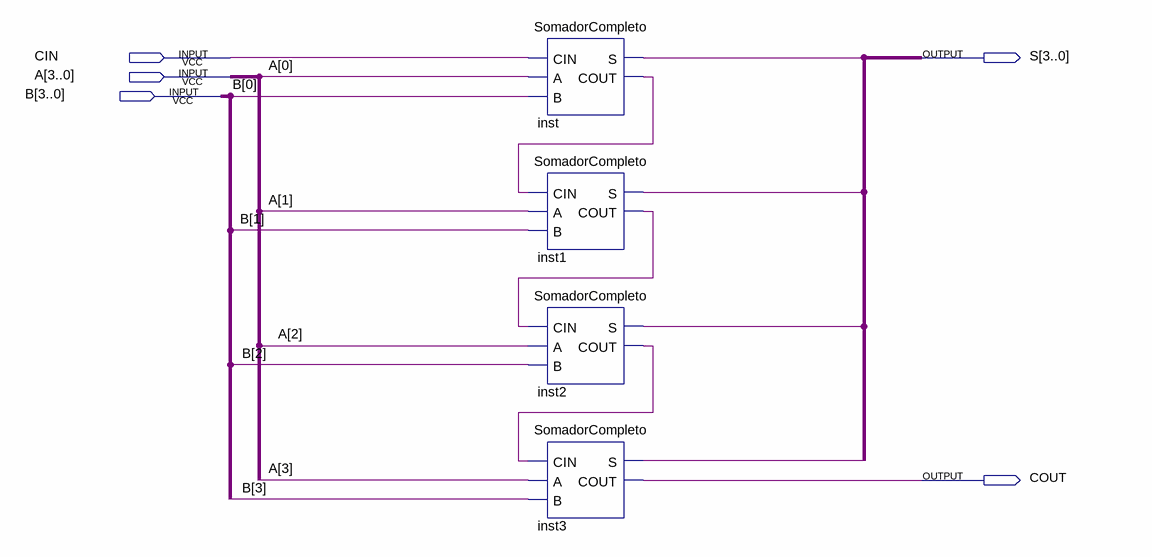
[diagram p0: schematic sheet]
// Quartus schematic Somador4bits.bdf as structural Verilog: 4 symbols, 5 pins
module Somador4bits (
  input  CIN,
  input  [3:0] A,
  input  [3:0] B,
  output [3:0] S,
  output COUT
);

  wire inst1_cout, inst1_s, inst2_cout, inst2_s, inst3_s, inst_cout, inst_s;

  SomadorCompleto inst (.CIN(CIN), .A(A[0]), .B(B[0]), .S(inst_s), .COUT(inst_cout));
  SomadorCompleto inst1 (.CIN(inst_cout), .A(A[1]), .B(B[1]), .S(inst1_s), .COUT(inst1_cout));
  SomadorCompleto inst2 (.CIN(inst1_cout), .A(A[2]), .B(B[2]), .S(inst2_s), .COUT(inst2_cout));
  SomadorCompleto inst3 (.CIN(inst2_cout), .A(A[3]), .B(B[3]), .S(inst3_s), .COUT(COUT));
endmodule
